# Altium schematic sheet HK0J2071758B03.SchDoc
size A4; SheetNumber: 1; SheetTotal: 1
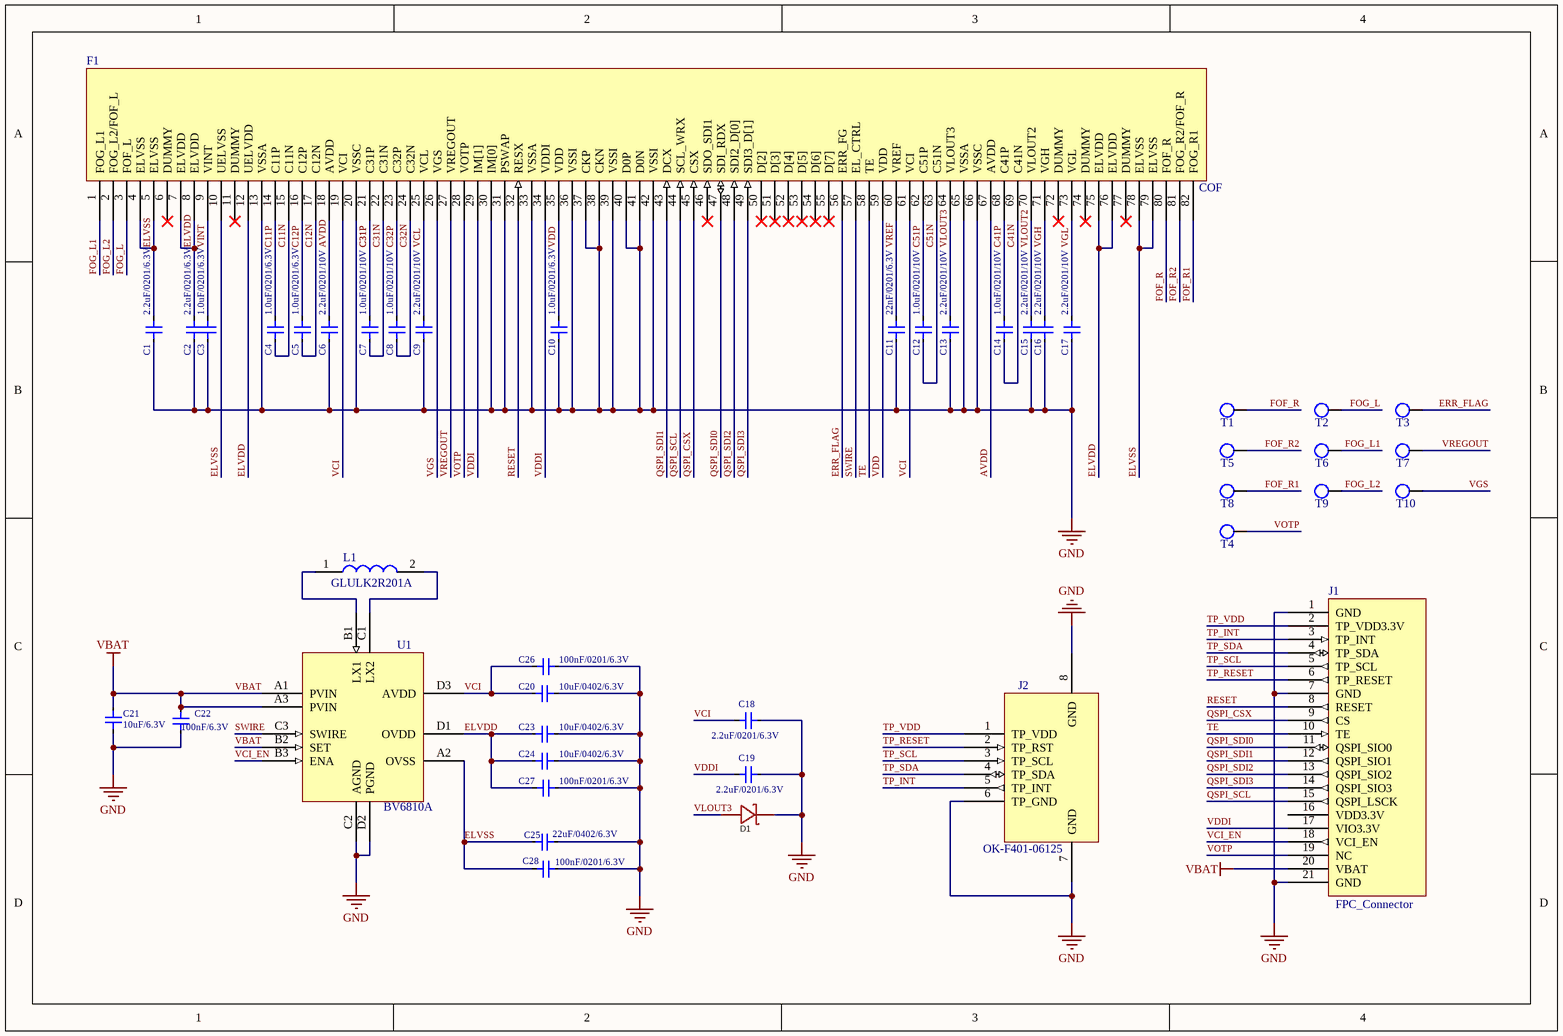
[diagram p0: HK0J2071758B03.SchDoc]

## Parts
C1  2.2uF/0201/6.3V  [CAPC0603X33N]
C2  2.2uF/0201/6.3V  [CAPC0603X33N]
C3  1.0uF/0201/6.3V  [CAPC0603X33N]
C4  1.0uF/0201/6.3V  [CAPC0603X33N]
C5  1.0uF/0201/6.3V  [CAPC0603X33N]
C6  2.2uF/0201/10V  [CAPC0603X33N]
C7  1.0uF/0201/10V  [CAPC0603X33N]
C8  1.0uF/0201/10V  [CAPC0603X33N]
C9  2.2uF/0201/10V  [CAPC0603X33N]
C10  1.0uF/0201/6.3V  [CAPC0603X33N]
C11  22nF/0201/6.3V  [CAPC0603X33N]
C12  1.0uF/0201/10V  [CAPC0603X33N]
C13  2.2uF/0201/10V  [CAPC0603X33N]
C14  1.0uF/0201/10V  [CAPC0603X33N]
C15  2.2uF/0201/10V  [CAPC0603X33N]
C16  2.2uF/0201/10V  [CAPC0603X33N]
C17  2.2uF/0201/10V  [CAPC0603X33N]
C18  2.2uF/0201/6.3V  [CAPC0603X33N]
C19  2.2uF/0201/6.3V  [CAPC0603X33N]
C20  10uF/0402/6.3V  [CAPC1005X57N]
C21  10uF/6.3V  [CAPC1005X57N]
C22  100nF/6.3V  [CAPC0603X33N]
C23  10uF/0402/6.3V  [CAPC1005X57N]
C24  10uF/0402/6.3V  [CAPC1005X57N]
C25  22uF/0402/6.3V  [CAPC1005X57N]
C26  100nF/0201/6.3V  [CAPC0603X33N]
C27  100nF/0201/6.3V  [CAPC0603X33N]
C28  100nF/0201/6.3V  [CAPC0603X33N]
D1  LDSR01S30ST5G  [DFN0603-D_L0.6-W0.3-P0.34-RD]  (value not drawn)
F1  COF  [COF Connector]
J1  FPC_Connector  [FPC Connector]
J2  OK-F401-06125  [FFC-SMD_6P-P0.50_FH34SRJ-6S-0.5SH]
L1  GLULK2R201A  [MPL2012S2R2MDT]
T1  Test_Point  [TP-C045-PI]  (value not drawn)
T2  Test_Point  [TP-C045-PI]  (value not drawn)
T3  Test_Point  [TP-C045-PI]  (value not drawn)
T4  Test_Point  [TP-C045-PI]  (value not drawn)
T5  Test_Point  [TP-C045-PI]  (value not drawn)
T6  Test_Point  [TP-C045-PI]  (value not drawn)
T7  Test_Point  [TP-C045-PI]  (value not drawn)
T8  Test_Point  [TP-C045-PI]  (value not drawn)
T9  Test_Point  [TP-C045-PI]  (value not drawn)
T10  Test_Point  [TP-C045-PI]  (value not drawn)
U1  BV6810A  [WLCSP-12_L1.7-W1.5-R4-C3-P0.40-TL-1]

## Nets
GND: C1.2 C2.2 C3.2 C6.2 C9.2 C10.2 C11.2 C13.2 C15.2 C16.2 C17.2 C18.2 C19.2 C20.1 C21.1 C22.2 C23.1 C24.1 C25.1 C26.2 C27.2 C28.2 D1.1(C) F1.13(VSSA) F1.20(VSSC) F1.30(IM[0]) F1.31(PSWAP) F1.33(VSSA) F1.36(VSSI) F1.37(CKP) F1.38(CKN) F1.39(VSSI) F1.40(D0P) F1.41(D0N) F1.42(VSSI) F1.65(VSSA) F1.66(VSSC) J1.1(GND) J1.7(GND) J1.21(GND) J2.6(TP_GND) J2.7(GND) J2.8(GND) U1.C2(AGND) U1.D2(PGND)
VBAT: C21.2 C22.1 J1.20(VBAT) U1.A1(PVIN) U1.A3(PVIN) U1.B2(SET)
AVDD: C6.1 F1.18(AVDD) F1.67(AVDD)
C11N: C4.2 F1.15(C11N)
C11P: C4.1 F1.14(C11P)
C12N: C5.2 F1.17(C12N)
C12P: C5.1 F1.16(C12P)
C31N: C7.2 F1.22(C31N)
C31P: C7.1 F1.21(C31P)
C32N: C8.2 F1.24(C32N)
C32P: C8.1 F1.23(C32P)
C41N: C14.2 F1.69(C41N)
C41P: C14.1 F1.68(C41P)
C51N: C12.2 F1.63(C51N)
C51P: C12.1 F1.62(C51P)
ELVDD: C2.1 C23.2 C24.2 C27.1 F1.7(ELVDD) F1.8(ELVDD) F1.12(UELVDD) F1.75(ELVDD) F1.76(ELVDD) U1.D1(OVDD)
ELVSS: C1.1 C25.2 C28.1 F1.4(ELVSS) F1.5(ELVSS) F1.10(UELVSS) F1.78(ELVSS) F1.79(ELVSS) U1.A2(OVSS)
ERR_FLAG: F1.56(ERR_FG) T3.1
FOF_R: F1.80(FOF_R) T1.1
FOF_R1: F1.82(FOG_R1) T8.1
FOF_R2: F1.81(FOG_R2/FOF_R) T5.1
FOG_L: F1.3(FOF_L) T2.1
FOG_L1: F1.1(FOG_L1) T6.1
FOG_L2: F1.2(FOG_L2/FOF_L) T9.1
QSPI_CSX: F1.45(CSX) J1.9(CS)
QSPI_SCL: F1.44(SCL_WRX) J1.15(QSPI_LSCK)
QSPI_SDI0: F1.47(SDI_RDX) J1.11(QSPI_SIO0)
QSPI_SDI1: F1.43(DCX) J1.12(QSPI_SIO1)
QSPI_SDI2: F1.48(SDI2_D[0]) J1.13(QSPI_SIO2)
QSPI_SDI3: F1.49(SDI3_D[1]) J1.14(QSPI_SIO3)
RESET: F1.32(RESX) J1.8(RESET)
SWIRE: F1.57(EL_CTRL) U1.C3(SWIRE)
TE: F1.58(TE) J1.10(TE)
TP_INT: J1.3(TP_INT) J2.5(TP_INT)
TP_RESET: J1.6(TP_RESET) J2.2(TP_RST)
TP_SCL: J1.5(TP_SCL) J2.3(TP_SCL)
TP_SDA: J1.4(TP_SDA) J2.4(TP_SDA)
TP_VDD: J1.2(TP_VDD3.3V) J2.1(TP_VDD)
VCI: C18.1 C20.2 C26.1 F1.19(VCI) F1.61(VCI) U1.D3(AVDD)
VCI_EN: J1.18(VCI_EN) U1.B3(ENA)
VCL: C9.1 F1.25(VCL)
VDD: C10.1 F1.35(VDD) F1.59(VDD)
VDDI: C19.1 F1.29(IM[1]) F1.34(VDDI) J1.17(VIO3.3V)
VGH: C16.1 F1.71(VGH)
VGL: C17.1 F1.73(VGL)
VGS: F1.26(VGS) T10.1
VINT: C3.1 F1.9(VINT)
VLOUT2: C15.1 F1.70(VLOUT2)
VLOUT3: C13.1 D1.2(A) F1.64(VLOUT3)
VOTP: F1.28(VOTP) J1.19(NC) T4.1
VREF: C11.1 F1.60(VREF)
VREGOUT: F1.27(VREGOUT) T7.1
NetL1_1: L1.1 U1.B1(LX1)
NetL1_2: L1.2 U1.C1(LX2)

Not connected (* = marked no-connect by the designer): F1 6(DUMMY)* 11(DUMMY)* 46(SDO_SDI1)* 50(D[2])* 51(D[3])* 52(D[4])* 53(D[5])* 54(D[6])* 55(D[7])* 72(DUMMY)* 74(DUMMY)* 77(DUMMY)*; J1 16(VDD3.3V)

## Library data of the parts
C1-C28 = Capacitor: NONE; Manufacturer: Murata; AMBIQ PN: GRM033R61A105ME15D; Capacitance: 1uF; Tolerance: 20%; Voltage Rating: 10V; Dielectric: X5R; Supplier 1: Arrow Electronics; Supplier Part Number 1: GRM033R61A105ME15D; Manufacturer Part Number: GRM033R61A105ME15D; RoHS: Yes; Category: Ceramic Capacitors; Stock 1: 387591; Pricing 1: 1=0.35440, 10=0.26860, 25=0.26600, 50=0.24050, 100=0.18220, 250=0.18020, 500=0.17800, 1000=0.12040, 3000=0.11920, 6000=0.08160,; Mount: Surface Mount; Case/Package: 0201; Case Code (Metric): 0603; Case Code (Imperial): 0201; Min Operating Temperature: -55°C; Max Operating Temperature: 85°C; Packaging: Tape and Reel; Voltage Rating (DC): 10V; Length: 0.024inch; Width: 0.012inch; Thickness: 0.015inch; RoHS Compliant: Yes; ComponentLink1URL: http://search.murata.co.jp/Ceramy/image/img/A01X/G101/ENG/GRM033R61A105ME15-01.pdf?src-supplier=Digi-Key; ComponentLink1Description: http://search.murata.co.jp/Ceramy/image/img/A01X/G101/ENG/GRM033R61A105ME15-01.pdf?src-supplier=Digi-Key
D1 = LDSR01S30ST5G: Manufacturer: LRC(乐山无线电); Add into BOM: yes; Forward Voltage (Vf@If): 0.62V; Reverse Voltage (Vr): 30V; Average Rectified Current (Io): 0.1A; Reverse Leakage Current (Ir): 0.35uA; Symbol: LDSR01S30ST5G; Device: LDSR01S30ST5G; LCSC Part Name: 电压:30V 电流:100mA; Supplier Part: C383209; Manufacturer Part: LDSR01S30ST5G; Supplier Footprint: DFN0603; JLCPCB Part Class: Extended Part; Datasheet: https://atta.szlcsc.com/upload/public/pdf/source/20190402/C383209_E6CC6AB1DDDAFF419D608D9457880F70.pdf; Supplier: LCSC; Convert to PCB: yes
J1 = 21Pin_Connector
L1 = GLULK2R201A: Inductor; Manufacturer_Name: Murata Electronics; Manufacturer_Part_Number: LQM2MPN2R2NG0L; Datasheet Link: https://psearch.en.murata.com/inductor/product/LQM2MPN2R2NG0%23.html; Height: 1mm; Mouser Part Number: 81-LQM2MPN2R2NG0L; Mouser Price/Stock: https://www.mouser.co.uk/ProductDetail/Murata-Electronics/LQM2MPN2R2NG0L?qs=%2F%252BYoplLUB5hok3HfggX2sA%3D%3D; Arrow Part Number: LQM2MPN2R2NG0L; Arrow Price/Stock: https://www.arrow.com/en/products/lqm2mpn2r2ng0l/murata-manufacturing?region=nac